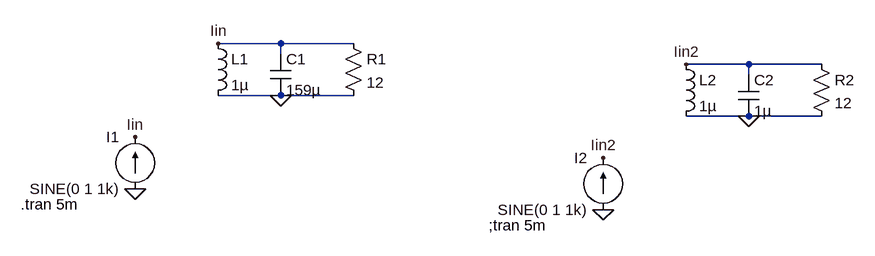
[diagram p0: schematic infinite_impedance_test.asc]
infinite_impedance_test.asc, the LTspice schematic file:
Version 4
SHEET 1 1128 680
WIRE 240 128 144 128
WIRE 352 128 240 128
WIRE 240 144 240 128
WIRE 960 160 864 160
WIRE 1072 160 960 160
WIRE 960 176 960 160
WIRE 240 208 144 208
WIRE 352 208 240 208
WIRE 960 240 864 240
WIRE 1072 240 960 240
FLAG 16 272 Iin
FLAG 144 128 Iin
FLAG 16 352 0
FLAG 240 208 0
FLAG 736 304 Iin2
FLAG 864 160 Iin2
FLAG 736 384 0
FLAG 960 240 0
SYMBOL ind 128 112 R0
SYMATTR InstName L1
SYMATTR Value 1µ
SYMBOL cap 224 144 R0
SYMATTR InstName C1
SYMATTR Value 159µ
SYMBOL res 336 112 R0
SYMATTR InstName R1
SYMATTR Value 12
SYMBOL current 16 352 R180
WINDOW 0 24 80 Left 2
WINDOW 3 24 0 Left 2
WINDOW 123 0 0 Left 0
WINDOW 39 0 0 Left 0
SYMATTR InstName I1
SYMATTR Value SINE(0 1 1k)
SYMBOL ind 848 144 R0
SYMATTR InstName L2
SYMATTR Value 1µ
SYMBOL cap 944 176 R0
SYMATTR InstName C2
SYMATTR Value 1µ
SYMBOL res 1056 144 R0
SYMATTR InstName R2
SYMATTR Value 12
SYMBOL current 736 384 R180
WINDOW 0 24 80 Left 2
WINDOW 3 24 0 Left 2
WINDOW 123 0 0 Left 0
WINDOW 39 0 0 Left 0
SYMATTR InstName I2
SYMATTR Value SINE(0 1 1k)
TEXT -160 376 Left 2 !.tran 5m
TEXT 560 408 Left 2 !;tran 5m

The netlist it stands for:
* infinite_impedance_test.asc
L1 Iin 0 1µ
C1 Iin 0 159µ
R1 Iin 0 12
I1 0 Iin SINE(0 1 1k)
L2 Iin2 0 1µ
C2 Iin2 0 1µ
R2 Iin2 0 12
I2 0 Iin2 SINE(0 1 1k)
.tran 5m
;tran 5m
.backanno
.end